# Altium schematic sheet RF Front End.SchDoc
size A3
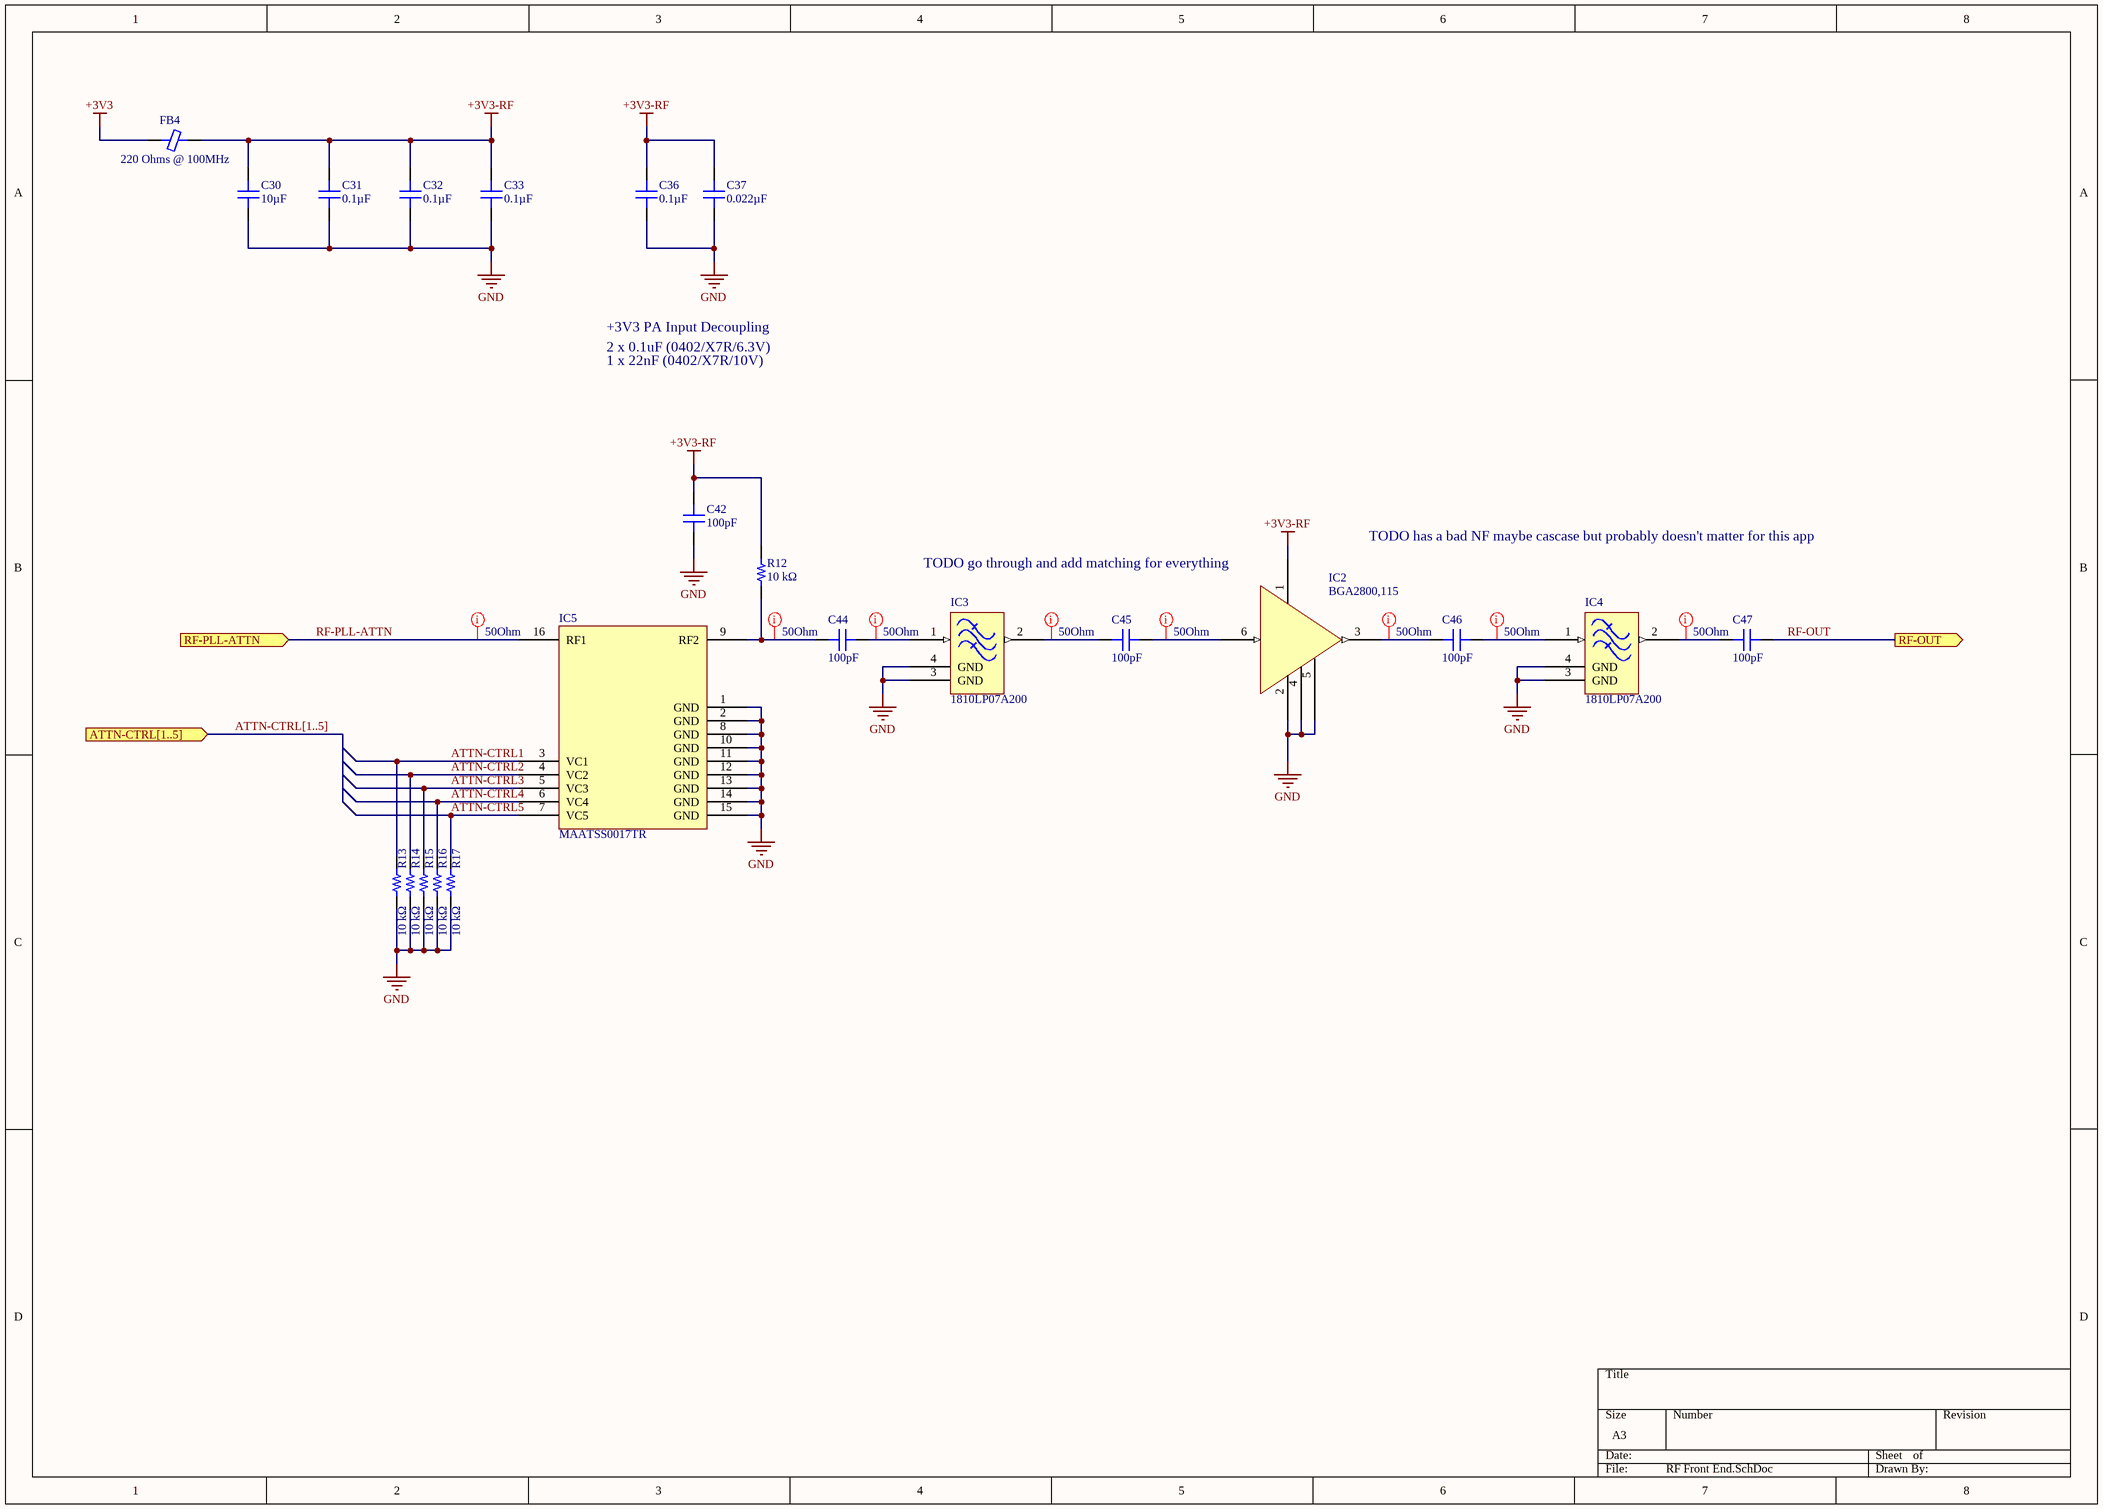
[diagram p0: RF Front End.SchDoc]

## Parts
C30  10µF  [CAP 0805_2012]
C31  0.1µF  [CAP 0402_1005]
C32  0.1µF  [CAP 0402_1005]
C33  0.1µF  [CAP 0402_1005]
C36  0.1µF  [CAP 0402_1005]
C37  0.022µF  [CAP 0402_1005]
C42  100pF  [CAP 0402_1005]
C44  100pF  [CAP 0402_1005 RF]
C45  100pF  [CAP 0402_1005 RF]
C46  100pF  [CAP 0402_1005 RF]
C47  100pF  [CAP 0402_1005 RF]
FB4  220 Ohms @ 100MHz  [FER 0402_1005]
IC2  BGA2800,115  [NXP SOT-363]
IC3  1810LP07A200  [JOHANSON 0402 4PAD]
IC4  1810LP07A200  [JOHANSON 0402 4PAD]
IC5  MAATSS0017TR  [TI TSSOP-16 PW]
R12  10 kΩ  [RES 0402_1005]
R13  10 kΩ  [RES 0402_1005]
R14  10 kΩ  [RES 0402_1005]
R15  10 kΩ  [RES 0402_1005]
R16  10 kΩ  [RES 0402_1005]
R17  10 kΩ  [RES 0402_1005]

## Ports
ATTN-CTRL[1..5] (in), RF-OUT (out), RF-PLL-ATTN (in)

## Nets
+3V3: FB4.2
+3V3-RF: C30.2 C31.2 C32.2 C33.2 C36.2 C37.1 C42.1 FB4.1 IC2.1(VCC) R12.2
GND: C30.1 C31.1 C32.1 C33.1 C36.1 C37.2 C42.2 IC2.2(GND) IC2.4(GND) IC2.5(GND) IC3.3(GND) IC3.4(GND) IC4.3(GND) IC4.4(GND) IC5.1(GND) IC5.2(GND) IC5.8(GND) IC5.10(GND) IC5.11(GND) IC5.12(GND) IC5.13(GND) IC5.14(GND) IC5.15(GND) R13.1 R14.1 R15.1 R16.1 R17.1
ATTN-CTRL1: IC5.3(VC1) R13.2
ATTN-CTRL2: IC5.4(VC2) R14.2
ATTN-CTRL3: IC5.5(VC3) R15.2
ATTN-CTRL4: IC5.6(VC4) R16.2
ATTN-CTRL5: IC5.7(VC5) R17.2
RF-OUT: C47.2 ; port RF-OUT
RF-PLL-ATTN: IC5.16(RF1) ; port RF-PLL-ATTN
NetC44_1: C44.1 IC5.9(RF2) R12.1
NetC44_2: C44.2 IC3.1(IN)
NetC45_1: C45.1 IC3.2(OUT)
NetC45_2: C45.2 IC2.6(RFIN)
NetC46_1: C46.1 IC2.3(RFOUT)
NetC46_2: C46.2 IC4.1(IN)
NetC47_1: C47.1 IC4.2(OUT)

## Buses and harness runs
bus ATTN-CTRL[1..5] = port ATTN-CTRL[1..5]

## Layout directives
net class 50Ohm: NetC44_1, NetC44_2, NetC45_1, NetC45_2, NetC46_1, NetC46_2, NetC47_1, RF-PLL-ATTN

## Notes on the sheet
- +3V3 PA Input Decoupling
- 2 x 0.1uF (0402/X7R/6.3V)
- 1 x 22nF (0402/X7R/10V)
- (near IC2) TODO go through and add matching for everything
- TODO has a bad NF maybe cascase but probably doesn't matter for this app

## Library data of the parts
C30 = 08056D106KAT4A: CAP CER 10UF 6.3V X5R 0805; Manufacturer: AVX Corporation; Tolerance: ±10%; Part Number: 08056D106KAT4A; Applications: General Purpose; Capacitance: 10µF; ComponentLink1Description: Datasheet; ComponentLink1URL: http://datasheets.avx.com/cx5r.pdf; ComponentLink2Description: DigiKey Link; ComponentLink2URL: http://digikey.com/product-detail/en/avx-corporation/08056D106KAT4A/478-10692-1-ND/7536564; Device Package: 0805 (2012 Metric); LastUpdated: 2020-02-03 5:06:37 PM; Lifecycle Status: Active; Minimum Order: 1; Mounting Type: Surface Mount, MLCC; Operating Temperature: -55°C ~ 85°C; Package / Case: 0805 (2012 Metric); Packaging: TapeAndReel; Part Status: Active; Price: 0.17; Series: -; Size / Dimension: 0.079" L x 0.049" W (2.01mm x 1.25mm); Supplier 1: DigiKey; Supplier Part Number 1: 478-10692-1-ND; Temperature Coefficient: X5R; Thickness (Max): 0.060" (1.52mm); Value: 10µF; Voltage - Rated: 6.3V
C31-C33 C36 = 0402B104K6R3CT: CAP CER 0.1UF 6.3V X7R 0402; Manufacturer: Walsin Technology Corporation; Tolerance: ±10%; Part Number: 0402B104K6R3CT; Applications: General Purpose; Capacitance: 0.1µF; ComponentLink1Description: Datasheet; ComponentLink1URL: http://www.passivecomponent.com/wp-content/uploads/2018/10/MLCC.pdf; ComponentLink2Description: DigiKey Link; ComponentLink2URL: http://digikey.com/product-detail/en/walsin-technology-corporation/0402B104K6R3CT/1292-1177-1-ND/9355181; Device Package: 0402 (1005 Metric); LastUpdated: 2020-02-03 5:04:43 PM; Lifecycle Status: Active; Minimum Order: 1; Mounting Type: Surface Mount, MLCC; Operating Temperature: -55°C ~ 125°C; Package / Case: 0402 (1005 Metric); Packaging: CutTape; Part Status: Active; Price: 0.10; Series: -; Size / Dimension: 0.039" L x 0.020" W (1.00mm x 0.50mm); Supplier 1: DigiKey; Supplier Part Number 1: 1292-1177-1-ND; Temperature Coefficient: X7R; Thickness (Max): 0.022" (0.55mm); Value: 0.1µF; Voltage - Rated: 6.3V
C37 = C0402C223K4RECAUTO: CAP CER 0402 22NF 16V X7R 10%; Manufacturer: KEMET; Part Number: C0402C223K4RECAUTO; Applications: Automotive, ESD Protection; Capacitance: 0.022µF; ComponentLink1Description: Datasheet; ComponentLink1URL: https://api.kemet.com/component-edge/download/datasheet/C0402C223K4RECAUTO.pdf; ComponentLink2Description: DigiKey Link; ComponentLink2URL: http://digikey.com/product-detail/en/kemet/C0402C223K4RECAUTO/399-17877-1-ND/8640544; Device Package: 0402 (1005 Metric); LastUpdated: 2020-02-03 5:04:46 PM; Lifecycle Status: Active; Minimum Order: 1; Mounting Type: Surface Mount, MLCC; Operating Temperature: -55°C ~ 125°C; Package / Case: 0402 (1005 Metric); Packaging: TapeAndReel; Part Status: Active; Price: 0.02; Ratings: AEC-Q200; Series: ESD SMD Auto X7R; Size / Dimension: 0.039" L x 0.020" W (1.00mm x 0.50mm); Supplier 1: DigiKey; Supplier Part Number 1: 399-17877-1-ND; Temperature Coefficient: X7R; Thickness (Max): 0.022" (0.55mm); Tolerance: ±10%; Value: 0.022µF; Voltage - Rated: 16V
C42 = 04023C101KAT2A: CAP CER 100PF 25V X7R 0402; Manufacturer: AVX Corporation; Tolerance: ±10%; Part Number: 04023C101KAT2A; Applications: General Purpose; Capacitance: 100pF; ComponentLink1Description: Datasheet; ComponentLink1URL: http://datasheets.avx.com/X7RDielectric.pdf; ComponentLink2Description: DigiKey Link; ComponentLink2URL: http://digikey.com/product-detail/en/avx-corporation/04023C101KAT2A/478-10080-1-ND/6797133; Device Package: 0402 (1005 Metric); LastUpdated: 2020-02-03 5:04:21 PM; Lifecycle Status: Active; Minimum Order: 1; Mounting Type: Surface Mount, MLCC; Operating Temperature: -55°C ~ 125°C; Package / Case: 0402 (1005 Metric); Packaging: TapeAndReel; Part Status: Active; Price: 0.01; Series: -; Size / Dimension: 0.039" L x 0.020" W (1.00mm x 0.50mm); Supplier 1: DigiKey; Supplier Part Number 1: 478-10080-1-ND; Temperature Coefficient: X7R; Thickness (Max): 0.022" (0.56mm); Value: 100pF; Voltage - Rated: 25V
C44-C47 = CBR04C101F3GAC: CAP CER 100PF 25V C0G/NP0 0402; Manufacturer: KEMET; Temperature Coefficient: C0G, NP0; Tolerance: ±1%; Part Number: CBR04C101F3GAC; Applications: RF, Microwave, High Frequency; Capacitance: 100pF; ComponentLink1Description: Datasheet; ComponentLink1URL: https://api.kemet.com/component-edge/download/datasheet/CBR04C101F3GAC.pdf; ComponentLink2Description: DigiKey Link; ComponentLink2URL: http://digikey.com/product-detail/en/kemet/CBR04C101F3GAC/399-11246-1-ND/4376873; Device Package: 0402 (1005 Metric); Features: High Q, Low Loss, Ultra Low ESR; LastUpdated: 2020-02-03 5:10:12 PM; Lifecycle Status: Active; Minimum Order: 1; Mounting Type: Surface Mount, MLCC; Operating Temperature: -55°C ~ 125°C; Package / Case: 0402 (1005 Metric); Packaging: TapeAndReel; Part Status: Active; Price: 0.11; Series: CBR-SMD RF C0G; Size / Dimension: 0.039" L x 0.020" W (1.00mm x 0.50mm); Supplier 1: DigiKey; Supplier Part Number 1: 399-11246-1-ND; Thickness (Max): 0.022" (0.55mm); Value: 100pF; Voltage - Rated: 25V
FB4 = BBPY00100505221Y00: EMI BEAD FILETER; Manufacturer: Chilisin Electronics; Current Rating (Max): 1.1A; Number of Lines: 1; Part Number: BBPY00100505221Y00; ComponentLink1Description: Datasheet; ComponentLink1URL: https://www.chilisin.com/upload/media/product/emi_bead/file/BBPY_Series.pdf; ComponentLink2Description: DigiKey Link; ComponentLink2URL: http://digikey.com/product-detail/en/chilisin-electronics/BBPY00100505221Y00/2184-BBPY00100505221Y00CT-ND/10509222; Device Package: 0402 (1005 Metric); Height (Max): 0.024" (0.60mm); Impedance @ Frequency: 220 Ohms @ 100MHz; LastUpdated: 2020-02-03 5:15:17 PM; Lifecycle Status: Active; Minimum Order: 1; Mounting Type: Surface Mount; Operating Temperature: -55°C ~ 125°C; Package / Case: 0402 (1005 Metric); Packaging: Unknown; Part Status: Active; Price: 0.01; Series: *; Size / Dimension: 0.039" L x 0.020" W (1.00mm x 0.50mm); Supplier 1: DigiKey; Supplier Part Number 1: 2184-BBPY00100505221Y00CT-ND; Value: 220 Ohms @ 100MHz
IC2 = BGA2800,115: IC RF AMP GP 0HZ-2.2GHZ 6TSSOP; Manufacturer: NXP USA Inc.; Frequency: 0Hz ~ 2.2GHz; RF Type: General Purpose; Part Number: BGA2800,115; ComponentLink1Description: Datasheet; ComponentLink1URL: https://www.nxp.com/docs/en/data-sheet/BGA2800.pdf; ComponentLink2Description: DigiKey Link; ComponentLink2URL: https://www.digikey.com/en/products/detail/nxp-usa-inc/BGA2800115/2406097; Device Package: 6-TSSOP; LastUpdated: 2021-02-16 1:45:27 AM; Lifecycle Status: 1; Minimum Order: 1; Package / Case: 6-TSSOP, SC-88, SOT-363; Packaging: TapeAndReel; Part Status: Active; Price: 0.17; Series: -; Supplier 1: DigiKey; Supplier Part Number 1: 568-6207-2-ND; Supplier Device Package: 6-TSSOP
IC3 IC4 = 1810LP07A200: RF FILTER LOW PASS 1.81GHZ 0402; Manufacturer: Johanson Technology Inc.; Bandwidth: 200MHz; Frequency: 1.81GHz Center; Insertion Loss: 0.5dB; Part Number: 1810LP07A200; ComponentLink1Description: Datasheet; ComponentLink1URL: https://www.johansontechnology.com/datasheets/1810LP07A200/1810LP07A200.pdf; ComponentLink2Description: DigiKey Link; ComponentLink2URL: https://www.digikey.com/en/products/detail/johanson-technology-inc/1810LP07A200T/1560795; Device Package: 0402 (1005 Metric), 4 PC Pad; Filter Type: Low Pass; Height (Max): 0.017" (0.43mm); LastUpdated: 2021-03-20 5:15:53 AM; Lifecycle Status: Active; Minimum Order: 1; Mounting Type: Surface Mount; Package / Case: 0402 (1005 Metric), 4 PC Pad; Packaging: TapeAndReel; Part Status: Active; Price: 0.73; Size / Dimension: 0.039" L x 0.020" W (1.00mm x 0.50mm); Supplier 1: DigiKey; Supplier Part Number 1: 712-1124-2-ND
IC5 = MAATSS0017TR: RF Attenuators 15.5dB 400MHz ~ 2.5GHz 50 Ohms 16-LSSOP (0.154", 3.90mm Width); Manufacturer: MACOM Technology Solutions; Frequency Range: 500MHz ~ 2GHz; Impedance: 50 Ohms; Part Number: MAATSS0017TR; ComponentLink1Description: Datasheet; ComponentLink1URL: http://cdn.macom.com/datasheets/MAATSS0017.pdf; ComponentLink2Description: DigiKey Link; ComponentLink2URL: https://www.digikey.com/en/products/detail/macom-technology-solutions/MAATSS0017TR/4429710; Device Package: 16-LSSOP; LastUpdated: 2021-02-16 1:31:48 AM; Lifecycle Status: 1; Minimum Order: 1; Mounting Type: Surface Mount; Package / Case: 16-LSSOP (0.154"", 3.90mm Width); Packaging: Tape & Reel (TR); Part Status: Active; Price: 6.5; Supplier 1: DigiKey; Supplier Part Number 1: 1465-1294-2-ND
R12-R17 = ASC0402-10KF1: RES 10 KOHM 1% 1/16W 0402; Manufacturer: Riedon; Power (Watts): 0.063W, 1/16W; Temperature Coefficient: ±100ppm/°C; Value: 10 kOhms; Part Number: ASC0402-10KF1; ComponentLink1Description: Datasheet; ComponentLink1URL: https://riedon.com/media/pdf/ASC.pdf; ComponentLink2Description: DigiKey Link; ComponentLink2URL: http://digikey.com/product-detail/en/riedon/ASC0402-10KF1/696-1775-1-ND/7398745; Composition: Thick Film; Device Package: 0402 (1005 Metric); Features: Anti-Sulfur, Automotive AEC-Q200, Moisture Resistant; Height - Seated (Max): 0.016" (0.40mm); LastUpdated: 2020-02-19 6:28:05 AM; Lifecycle Status: Active; Minimum Order: 1; Number of Terminations: 2; Operating Temperature: -55°C ~ 155°C; Package / Case: 0402 (1005 Metric); Packaging: TapeAndReel; Part Status: Active; Price: 0.01; Ratings: AEC-Q200; Resistance: 10 kΩ; Series: ASC; Size / Dimension: 0.039" L x 0.020" W (1.00mm x 0.50mm); Supplier 1: DigiKey; Supplier Part Number 1: 696-1775-1-ND; Supplier Device Package: 0402; Tolerance: ±1%